# EAGLE design RQ2_supply_v0.1 (EAGLE 7.6.0)
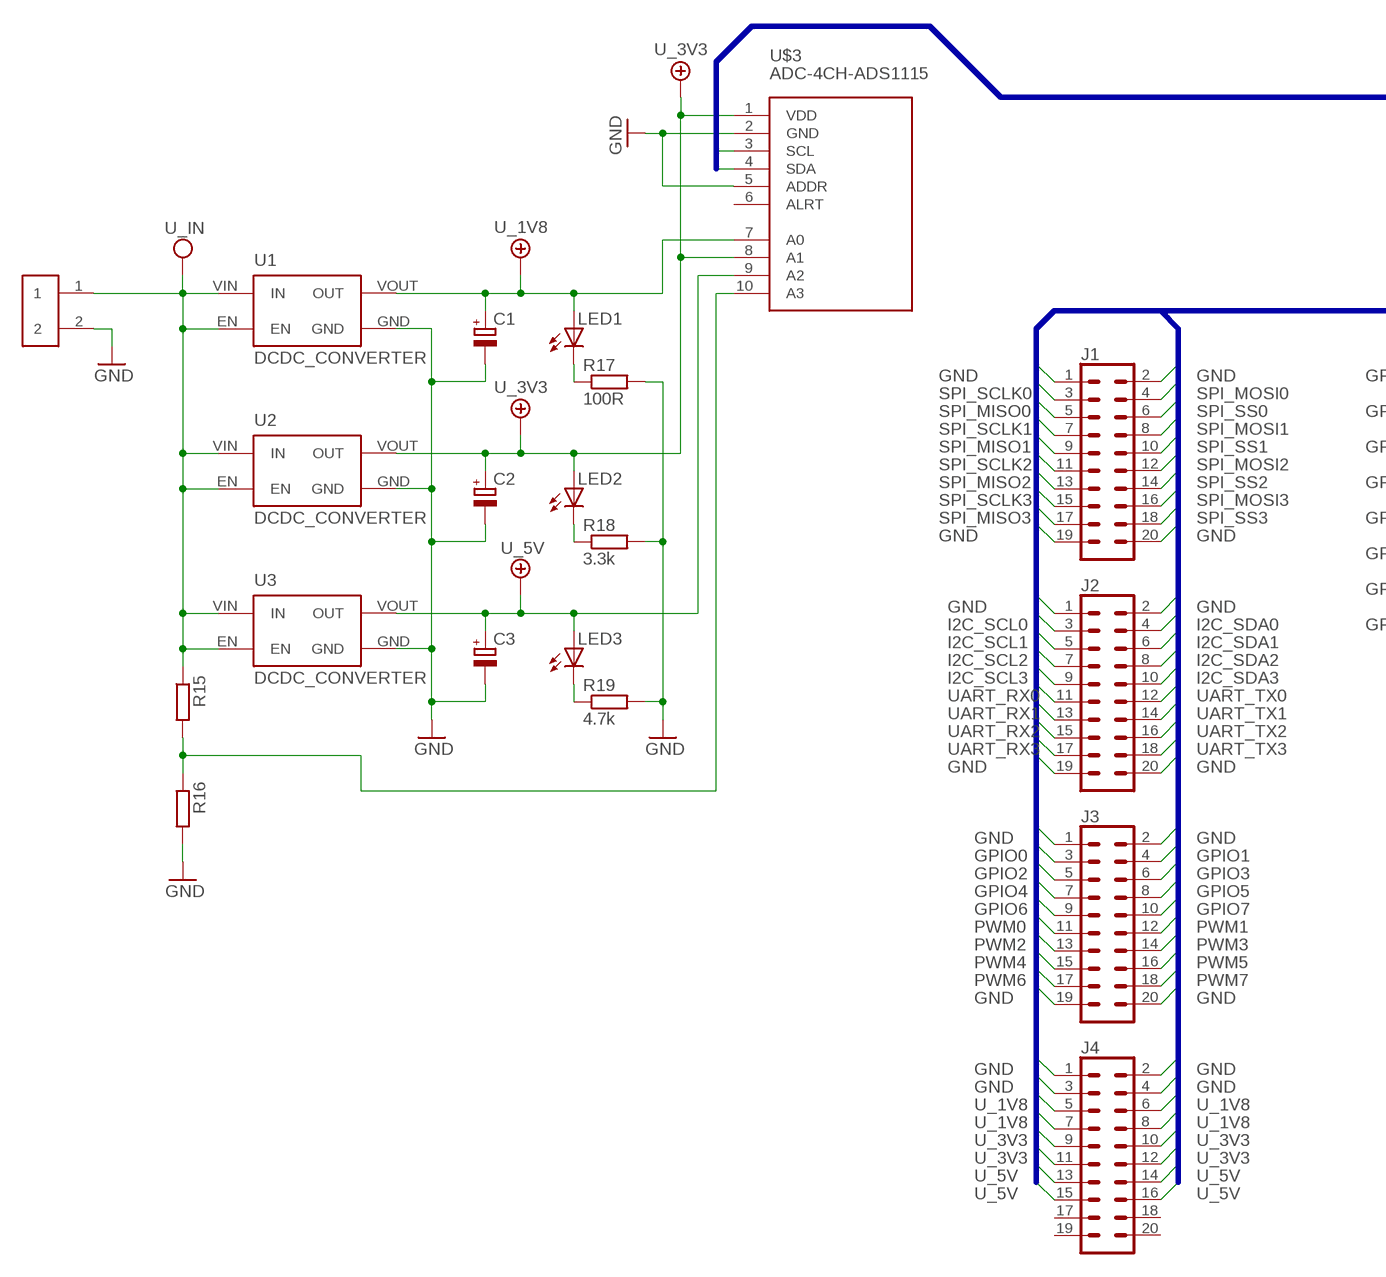
[diagram p0: schematic, sheet 1, part 1 of 2]
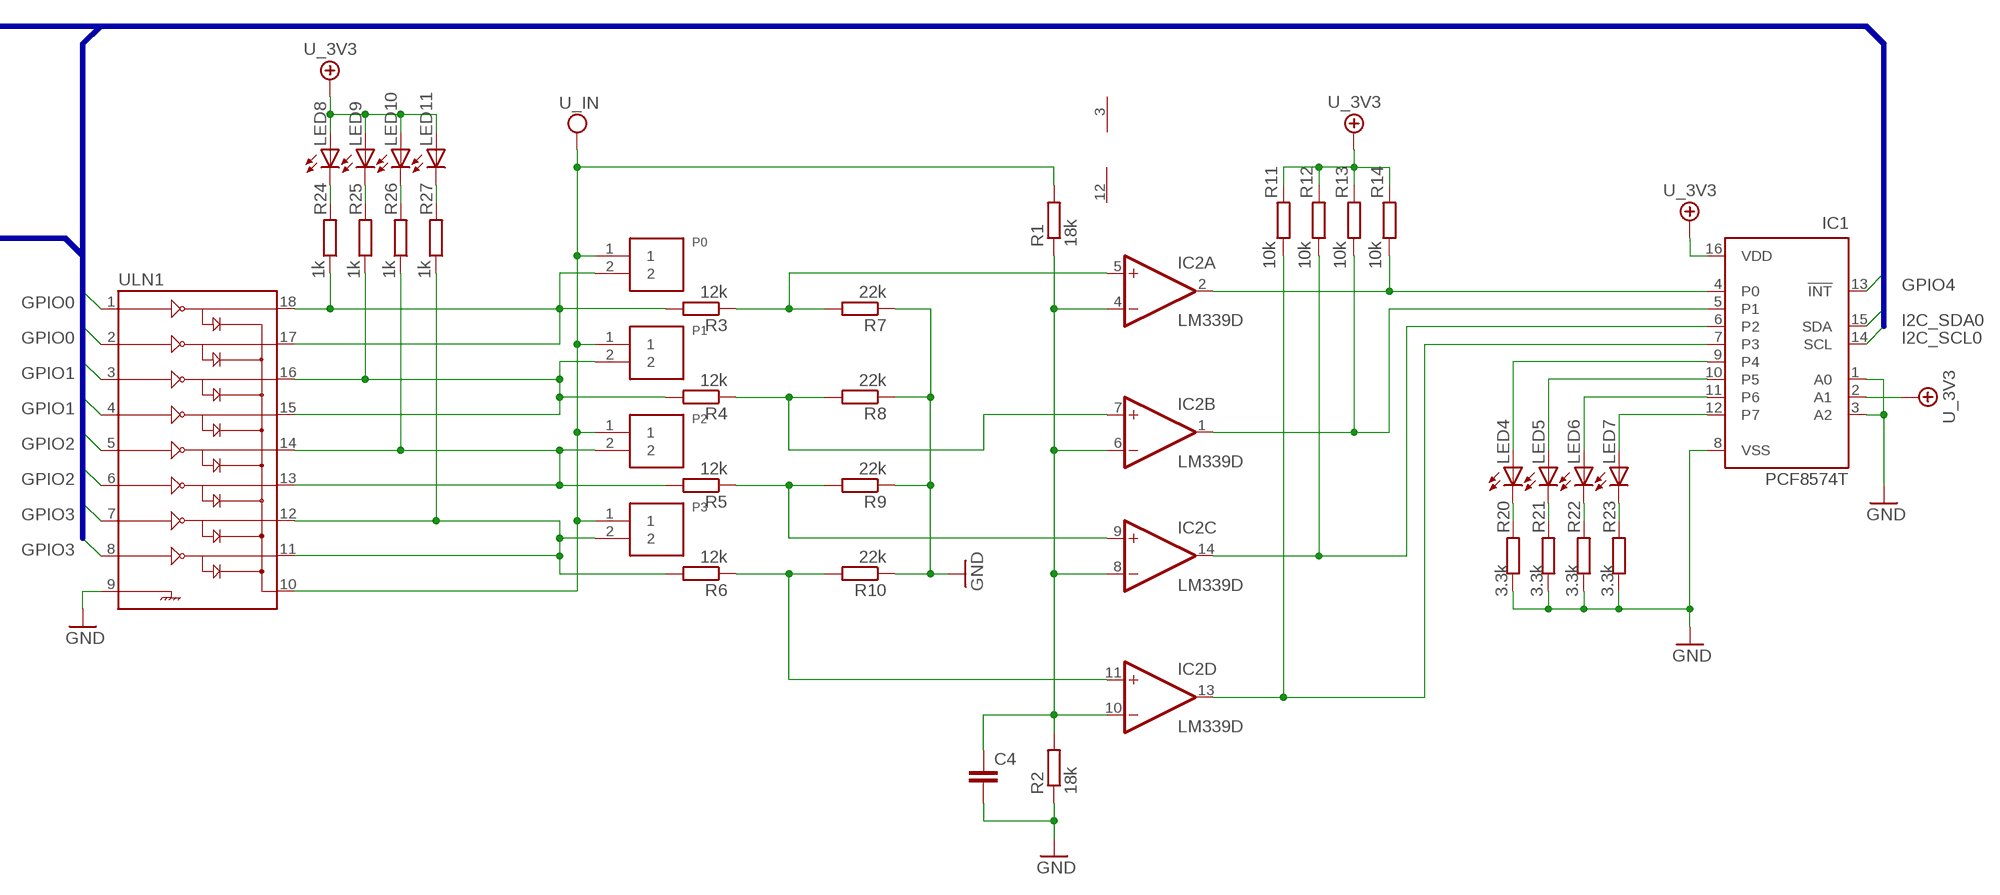
[diagram p1: schematic, sheet 1, part 2 of 2]

## Parts
C1  CPOL-EUSANYO_E9  [SANYO-OSCON_E9]
C2  CPOL-EUSANYO_E9  [SANYO-OSCON_E9]
C3  CPOL-EUSANYO_E9  [SANYO-OSCON_E9]
C4  C-EUC0805  [C0805]
IC1  PCF8574T  [SO16W]
IC2  LM339D  [SO14]
J1  CONN_10X2  [2X10]
J2  CONN_10X2  [2X10]
J3  CONN_10X2  [2X10]
J4  CONN_10X2  [2X10]
LED1  LEDSML0805  [SML0805]
LED2  LEDSML0805  [SML0805]
LED3  LEDSML0805  [SML0805]
LED4  LEDSML0805  [SML0805]
LED5  LEDSML0805  [SML0805]
LED6  LEDSML0805  [SML0805]
LED7  LEDSML0805  [SML0805]
LED8  LEDSML0805  [SML0805]
LED9  LEDSML0805  [SML0805]
LED10  LEDSML0805  [SML0805]
LED11  LEDSML0805  [SML0805]
P0  2PIN  [B2B-PH-K-S]
P1  2PIN  [B2B-PH-K-S]
P2  2PIN  [B2B-PH-K-S]
P3  2PIN  [B2B-PH-K-S]
R1  18k  R-EU_R0805  [R0805]
R2  18k  R-EU_R0805  [R0805]
R3  12k  R-EU_R0805  [R0805]
R4  12k  R-EU_R0805  [R0805]
R5  12k  R-EU_R0805  [R0805]
R6  12k  R-EU_R0805  [R0805]
R7  22k  R-EU_R0805  [R0805]
R8  22k  R-EU_R0805  [R0805]
R9  22k  R-EU_R0805  [R0805]
R10  22k  R-EU_R0805  [R0805]
R11  10k  R-EU_R0805  [R0805]
R12  10k  R-EU_R0805  [R0805]
R13  10k  R-EU_R0805  [R0805]
R14  10k  R-EU_R0805  [R0805]
R15  R-EU_R0805  [R0805]
R16  R-EU_R0805  [R0805]
R17  100R  R-EU_R0805  [R0805]
R18  3.3k  R-EU_R0805  [R0805]
R19  4.7k  R-EU_R0805  [R0805]
R20  3.3k  R-EU_R0805  [R0805]
R21  3.3k  R-EU_R0805  [R0805]
R22  3.3k  R-EU_R0805  [R0805]
R23  3.3k  R-EU_R0805  [R0805]
R24  1k  R-EU_R0805  [R0805]
R25  1k  R-EU_R0805  [R0805]
R26  1k  R-EU_R0805  [R0805]
R27  1k  R-EU_R0805  [R0805]
U1  DCDC_CONVERTER  [DCDC_CONVERTER]
U2  DCDC_CONVERTER  [DCDC_CONVERTER]
U3  DCDC_CONVERTER  [DCDC_CONVERTER]
U$1  XT_CONN  [XT30_PCB]
U$3  ADC-4CH-ADS1115  [ADC-4CH-ADS1115]
ULN1  ULN2803SOICW  [SO18L]

## Nets
COMPARE: C4.1 IC2.4(A:-IN) IC2.6(B:-IN) IC2.8(C:-IN) IC2.10(D:-IN) R1.1 R2.2
GND: C1.- C2.- C3.- C4.2 IC1.1(A0) IC1.3(A2) IC1.8(VSS) J1.1 J1.2 J1.19 J1.20 J2.1 J2.2 J2.19 J2.20 J3.1 J3.2 J3.19 J3.20 J4.1 J4.2 J4.3 J4.4 R2.1 R7.1 R8.1 R9.1 R10.1 R16.2 R17.2 R18.2 R19.2 R20.1 R21.1 R22.1 R23.1 U1.GND U2.GND U3.GND U$1.2 U$3.2(GND) U$3.5(ADDR) ULN1.9
GPIO0: J3.3 ULN1.1 ULN1.2
GPIO1: J3.4 ULN1.3 ULN1.4
GPIO2: J3.5 ULN1.5 ULN1.6
GPIO3: J3.6 ULN1.7 ULN1.8
GPIO4: IC1.13(!INT) J3.7
GPIO5: J3.8
GPIO6: J3.9
GPIO7: J3.10
I2C_SCL0: IC1.14(SCL) J2.3 U$3.3(SCL)
I2C_SCL1: J2.5
I2C_SCL2: J2.7
I2C_SCL3: J2.9
I2C_SDA0: IC1.15(SDA) J2.4 U$3.4(SDA)
I2C_SDA1: J2.6
I2C_SDA2: J2.8
I2C_SDA3: J2.10
LED4: LED4.C R20.2
LED5: LED5.C R21.2
LED6: LED6.C R22.2
LED7: LED7.C R23.2
N$1: R15.2 R16.1 U$3.10(A3)
N$2: LED1.C R17.1
N$3: LED2.C R18.1
N$4: LED3.C R19.1
N$5: LED8.C R24.2
N$6: LED9.C R25.2
N$7: LED10.C R26.2
N$8: LED11.C R27.2
NOT_BLOWN0: IC1.4(P0) IC2.2(A:OUT) R14.1
NOT_BLOWN1: IC1.5(P1) IC2.1(B:OUT) R13.1
NOT_BLOWN2: IC1.6(P2) IC2.14(C:OUT) R12.1
NOT_BLOWN3: IC1.7(P3) IC2.13(D:OUT) R11.1
P4: IC1.9(P4) LED4.A
P5: IC1.10(P5) LED5.A
P6: IC1.11(P6) LED6.A
P7: IC1.12(P7) LED7.A
PWM0: J3.11
PWM1: J3.12
PWM2: J3.13
PWM3: J3.14
PWM4: J3.15
PWM5: J3.16
PWM6: J3.17
PWM7: J3.18
PYRO0: P0.2 R3.2 R24.1 ULN1.17 ULN1.18
PYRO1: P1.2 R4.2 R25.1 ULN1.15 ULN1.16
PYRO2: P2.2 R5.2 R26.1 ULN1.13 ULN1.14
PYRO3: P3.2 R6.2 R27.1 ULN1.11 ULN1.12
PYRO_PROBE0: IC2.5(A:+IN) R3.1 R7.2
PYRO_PROBE1: IC2.7(B:+IN) R4.1 R8.2
PYRO_PROBE2: IC2.9(C:+IN) R5.1 R9.2
PYRO_PROBE3: IC2.11(D:+IN) R6.1 R10.2
SPI_MISO0: J1.5
SPI_MISO1: J1.9
SPI_MISO2: J1.13
SPI_MISO3: J1.17
SPI_MOSI0: J1.4
SPI_MOSI1: J1.8
SPI_MOSI2: J1.12
SPI_MOSI3: J1.16
SPI_SCLK0: J1.3
SPI_SCLK1: J1.7
SPI_SCLK2: J1.11
SPI_SCLK3: J1.15
SPI_SS0: J1.6
SPI_SS1: J1.10
SPI_SS2: J1.14
SPI_SS3: J1.18
U_1V8: C1.+ J4.5 J4.6 J4.7 J4.8 LED1.A U1.VOUT(OUT) U$3.7(A0)
U_3V3: C2.+ IC1.2(A1) IC1.16(VDD) J4.9 J4.10 J4.11 J4.12 LED2.A LED8.A LED9.A LED10.A LED11.A R11.2 R12.2 R13.2 R14.2 U2.VOUT(OUT) U$3.1(VDD) U$3.8(A1)
U_5V: C3.+ J4.13 J4.14 J4.15 J4.16 LED3.A U3.VOUT(OUT) U$3.9(A2)
U_IN: P0.1 P1.1 P2.1 P3.1 R1.2 R15.1 U1.EN U1.VIN(IN) U2.EN U2.VIN(IN) U3.EN U3.VIN(IN) U$1.1 ULN1.10
UART_RX0: J2.11
UART_RX1: J2.13
UART_RX2: J2.15
UART_RX3: J2.17
UART_TX0: J2.12
UART_TX1: J2.14
UART_TX2: J2.16
UART_TX3: J2.18
Unconnected: J4.17 J4.18 J4.19 J4.20 U$3.6(ALRT)

## Buses
SPI_SCLK[0..3],SPI_MOSI[0..3],SPI_MISO[0..3],SPI_SS[0..3],I2C_SCL[0..3],I2C_SDA[0..3],SD0_CLK,SD0_CMD,SD0_DAT[0..3],SD1_CLK,SD1_CMD,SD1_DAT[0..3],GPIO[0..7],ADC[0..7],PWM[0..7],UART_RX[0..3],UART_TX[0..3],RESET_N,XIN,XOUT,U_1V8,U_3V3,U_5V,U_IN,GND

## Power pins joined to a net without a drawn wire
GND: IC2.12(P:GND)
V+: IC2.3(P:V+)

## Library data of the parts
C1-C3 = rcl:CPOL-EU: POLARIZED CAPACITOR, European symbol
C4 = rcl:C-EU: CAPACITOR, European symbol
IC1 = micro-philips:PCF8574: I2C-Bus Remote 8-bit I/O expander http://www.semiconductors.philips.com/acrobat_download/datasheets/PCF8574_4.pdf; MPN: PCF8574T/3,512; OC_FARNELL: 1201255; OC_NEWARK: 70R6870
IC2 = linear:LM339: Low Power Low Offset Voltage Quad Comparators with open collector; LM139/LM239/LM339/LM2901/LM3302
J1-J4 = SparkFun-Connectors:CONN_10X2: Multi connection point. Often used as Generic Header-pin footprint for 0.1 inch spaced/style header connections On any of the 0.1 inch spaced packages, you can populate with these: Break Away Headers - Straight <https://www.sparkfun.com/products/116> (PRT-00116) Break Away Male Headers - Right Angle <https://www.sparkfun.com/products/553> (PRT-00553) Female Headers <https://www.sparkfun.com/products/115> (PRT-00115) Break Away Headers - Machine Pin <https://www.sparkfun.com/products/117> (PRT-00117) Break Away Female Headers - Swiss Machine Pin <https://www.sparkfun.com/products/743> (PRT-00743) Special note about the "SPECIAL" package: This was SPECIALLY designed to be used with our Graphic LCD Backpack. Be sure you want to use this! It is not only staggered on each line of header holes, but IT IS ALSO offset of the center point of the top and bottom lines by 5 mil. This causes the headers to lock into place on the "standard" footprint on the LCD screen. The extra squares on the tdocu layer are there simply to reference other pins (if you were to actually populate a longer header than ten long - this is what we do with the backpacks).
LED1-LED11 = led:LED: LED OSRAM: - CHIPLED LG R971, LG N971, LY N971, LG Q971, LY Q971, LO R971, LY R971 LH N974, LH R974 LS Q976, LO Q976, LY Q976 LO Q996 - Hyper CHIPLED LW Q18S LB Q993, LB Q99A, LB R99A - SideLED LS A670, LO A670, LY A670, LG A670, LP A670 LB A673, LV A673, LT A673, LW A673 LH A674 LY A675 LS A676, LA A676, LO A676, LY A676, LW A676 LS A679, LY A679, LG A679 - Hyper Micro SIDELED® LS Y876, LA Y876, LO Y876, LY Y876 LT Y87S - SmartLED LW L88C, LW L88S LB L89C, LB L89S, LG L890 LS L89K, LO L89K, LY L89K LS L896, LA L896, LO L896, LY L896 - TOPLED LS T670, LO T670, LY T670, LG T670, LP T670 LSG T670, LSP T670, LSY T670, LOP T670, LYG T670 LG T671, LOG T671, LSG T671 LB T673, LV T673, LT T673, LW T673 LH T674 LS T676, LA T676, LO T676, LY T676, LB T676, LH T676, LSB T676, LW T676 LB T67C, LV T67C, LT T67C, LS T67K, LO T67K, LY T67K, LW E67C LS E67B, LA E67B, LO E67B, LY E67B, LB E67C, LV E67C, LT E67C LW T67C LS T679, LY T679, LG T679 LS T770, LO T770, LY T770, LG T770, LP T770 LB T773, LV T773, LT T773, LW T773 LH T774 LS E675, LA E675, LY E675, LS T675 LS T776, LA T776, LO T776, LY T776, LB T776 LHGB T686 LT T68C, LB T68C - Hyper Mini TOPLED® LB M676 - Mini TOPLED Santana® LG M470 LS M47K, LO M47K, LY M47K Source: http://www.osram.convergy.de LUXEON: - LUMILED® LXK2-PW12-R00, LXK2-PW12-S00, LXK2-PW14-U00, LXK2-PW14-V00 LXK2-PM12-R00, LXK2-PM12-S00, LXK2-PM14-U00 LXK2-PE12-Q00, LXK2-PE12-R00, LXK2-PE12-S00, LXK2-PE14-T00, LXK2-PE14-U00 LXK2-PB12-K00, LXK2-PB12-L00, LXK2-PB12-M00, LXK2-PB14-N00, LXK2-PB14-P00, LXK2-PB14-Q00 LXK2-PR12-L00, LXK2-PR12-M00, LXK2-PR14-Q00, LXK2-PR14-R00 LXK2-PD12-Q00, LXK2-PD12-R00, LXK2-PD12-S00 LXK2-PH12-R00, LXK2-PH12-S00 LXK2-PL12-P00, LXK2-PL12-Q00, LXK2-PL12-R00 Source: www.luxeon.com KINGBRIGHT: KA-3528ASYC Source: www.kingbright.com
P0 P1-P3 = jst_eph:2PIN
R1-R27 = rcl:R-EU_: RESISTOR, European symbol
U1-U3 = arduino_modules:DCDC_CONVERTER
U$1 = SparkFun-Connectors:XT_CONN
U$3 = diy-modules:ADC-4CH-ADS1115: 4 Channel 16-Bit Analog-to-Digital Converter based on ADS1115 chip Arduino ADS1115 Getting Started Tutorial is available here: http://henrysbench.capnfatz.com/henrys-bench/arduino-voltage-measurements/arduino-ads1115-module-getting-started-tutorial/ ADS1115 datasheet is available here: http://www.ti.com/lit/ds/symlink/ads1115.pdf Click here to find device on ebay.com <http://www.ebay.com/sch/ads1115+module>
ULN1 = SparkFun-IC-Special-Function:ULN2803: Darlington Driver(IC-07959, low stock) ULN2803 Darlington array. 500mA max per channel, 8-channel package. Spark Fun Electronics SKU : COM-00312

## Board
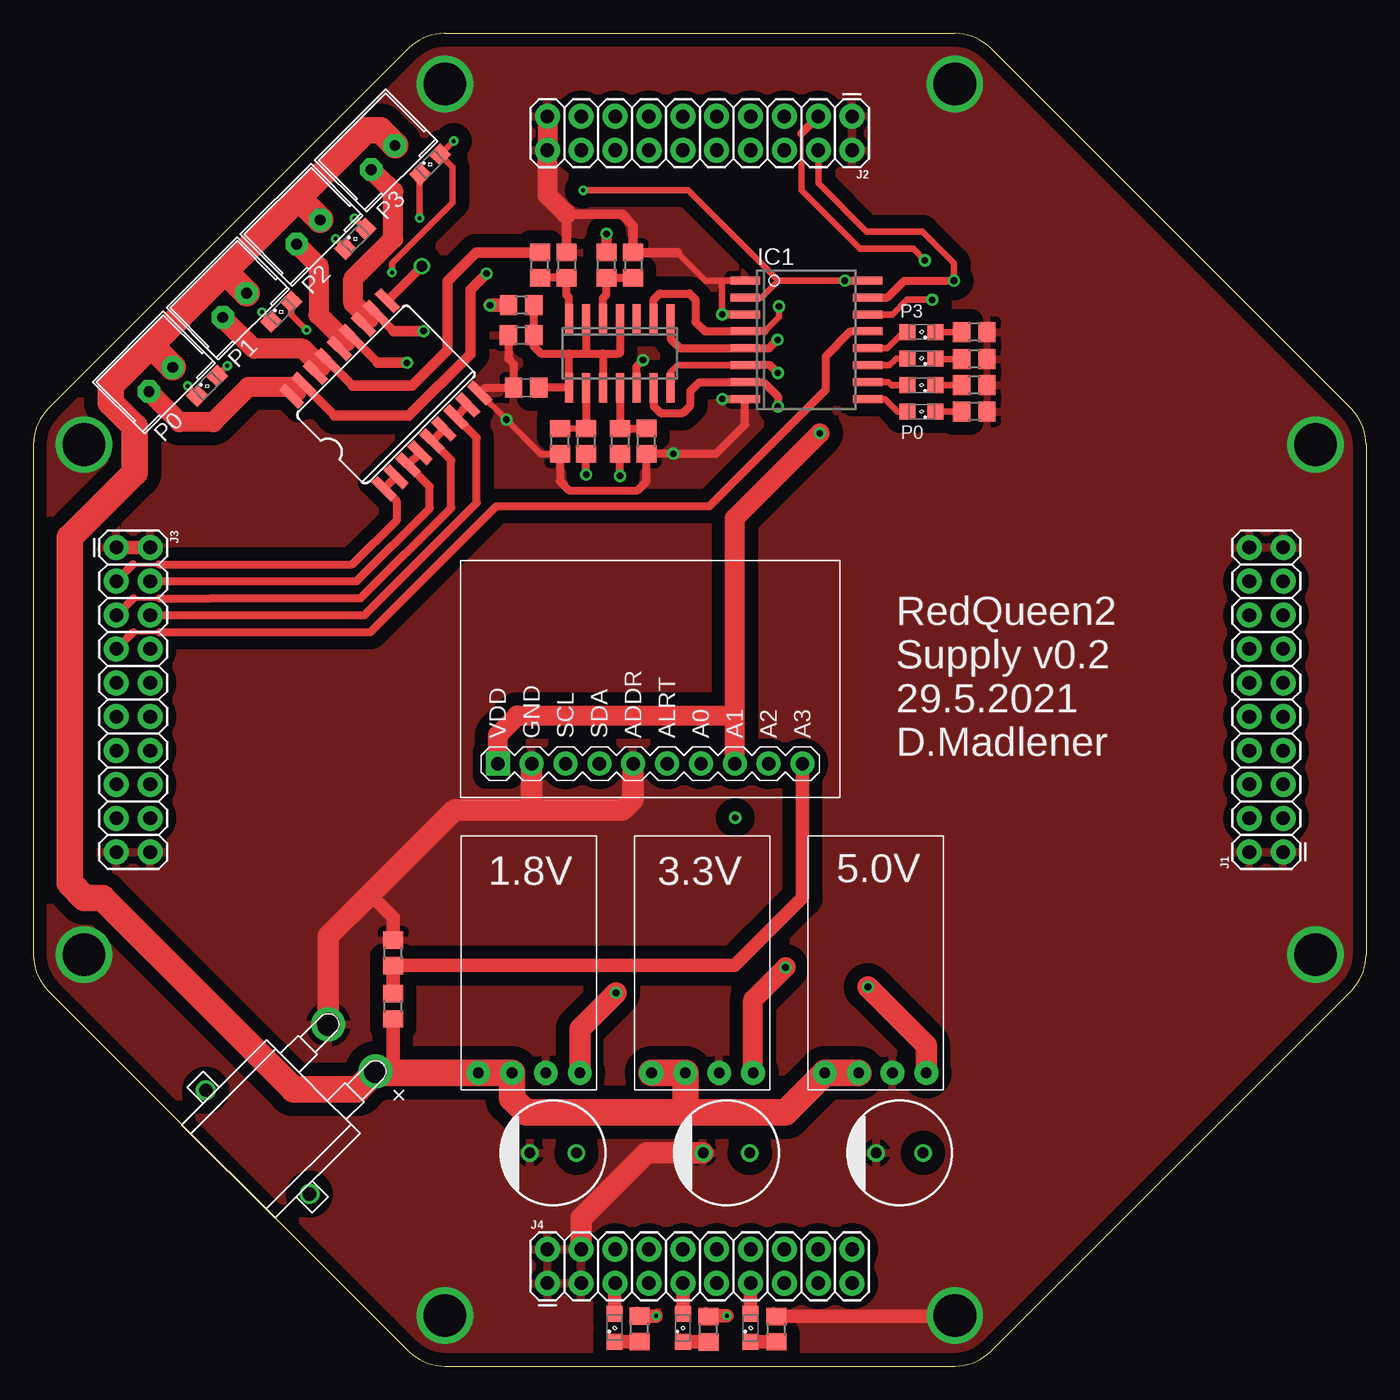
[diagram p2: board, top side]
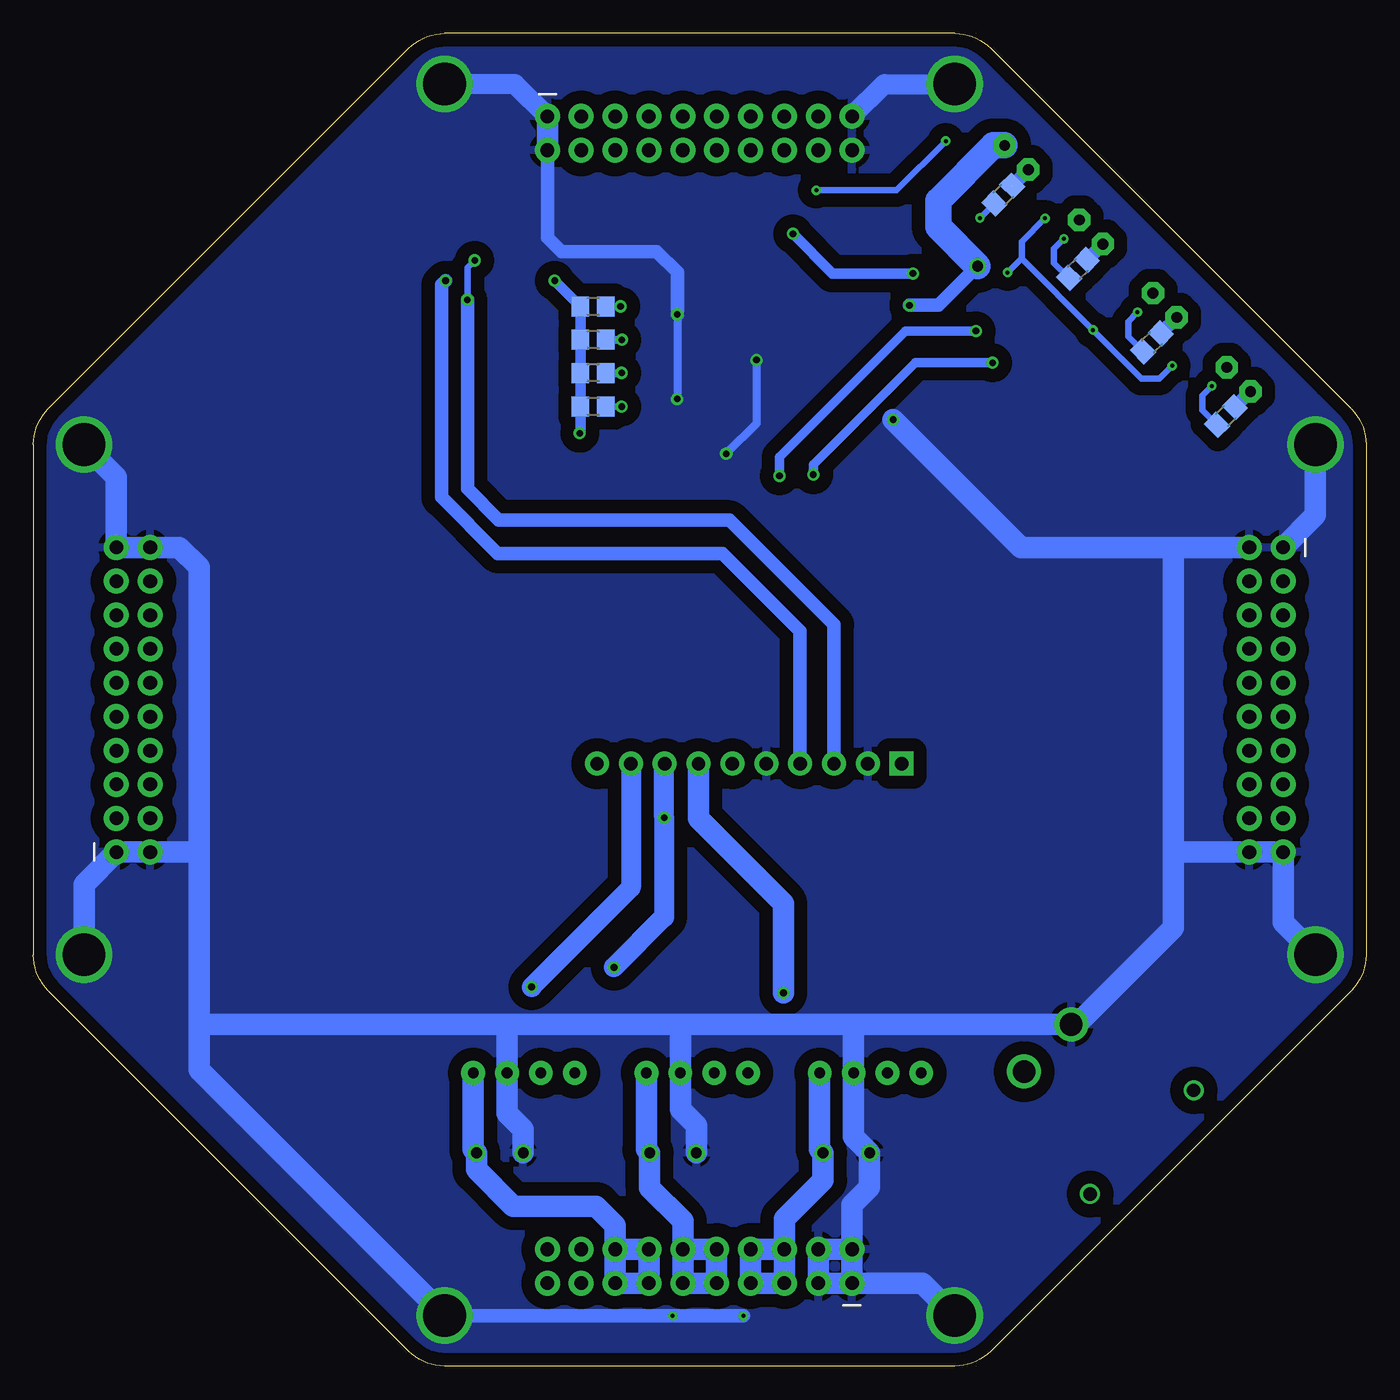
[diagram p3: board, bottom side, seen from below]

Size 100 x 100 mm. Coordinates in mm from the lower left corner, seen from the top.
Outline: 100,70.71 100,70.71
Outline: 100,29.29 100,29.29
Outline: 29.29,100 29.29,100
Outline: 70.71,100 70.71,100
Outline: 100,29.29 100,29.29
Outline: 70.71,0 70.71,0
Outline: 70.71,100 70.71,100
Outline: 100,70.71 100,70.71
Outline: 0,70.71 0,70.71
Outline: 26.36,97.07 26.36,97.07
Outline: 2.93,73.64 2.93,73.64
Outline: 29.29,100 29.29,100
Outline: 29.29,0 29.29,0
Outline: 2.93,26.36 2.93,26.36
Outline: 0,29.29 0,29.29
Outline: 0,70.71 0,70.71
Outline: 26.36,2.93 26.36,2.93
Outline: 0,29.29 0,29.29
Outline: 70.71,0 70.71,0
Outline: 29.29,0 29.29,0
Outline: 1.12,71.83 arc45 0,69.14 0,30.87 arc45 1.12,28.17 28.18,1.12 arc45 30.87,0 69.14,0 arc45 71.83,1.12 98.89,28.17 arc45 100,30.87 100,69.13 arc45 98.89,71.83 71.83,98.89 arc45 69.13,100 30.87,100 arc45 28.18,98.89 1.12,71.83
Copper layers (1*16): Top 0.035mm / dielectric 1.5mm / Bottom 0.035mm
Design rules "default *": minimum track width 10mil, minimum drill 0.3mm, track to track 6mil, track to pad 6mil, pad to pad 6mil, via to via 6mil, smd to smd 6mil, copper to edge 20mil, drill to drill 8mil, minimum pad ring 10mil, minimum via ring 8mil, stop-mask expansion 4mil, vias tented up to drill 0mil, thermal gap 16mil

### Footprints (pad centres in the part's own frame; a part is rotated, then mirrored left to right if it is on the bottom)
SANYO-OSCON_E9 = drill 0.8 pad 1.27: + 1.75,0; - -1.75,0
C0805 = smd 1.3 x 1.5: 1 -0.95,0; 2 0.95,0
SO16W = smd 0.6 x 2.2: 1 -4.445,-4.6; 2 -3.175,-4.6; 3 -1.905,-4.6; 4 -0.635,-4.6; 5 0.635,-4.6; 6 1.905,-4.6; 7 3.175,-4.6; 8 4.445,-4.6; 9 4.445,4.6; 10 3.175,4.6; 11 1.905,4.6; 12 0.635,4.6; 13 -0.635,4.6; 14 -1.905,4.6; 15 -3.175,4.6; 16 -4.445,4.6
SO14 = smd 0.6 x 2.2: 1 -3.81,-2.6; 2 -2.54,-2.6; 3 -1.27,-2.6; 4 0,-2.6; 5 1.27,-2.6; 6 2.54,-2.6; 7 3.81,-2.6; 8 3.81,2.6; 9 2.54,2.6; 10 1.27,2.6; 11 0,2.6; 12 -1.27,2.6; 13 -2.54,2.6; 14 -3.81,2.6
2X10 = drill 1.016 pad 1.88: 1 0,0; 2 0,2.54; 3 2.54,0; 4 2.54,2.54; 5 5.08,0; 6 5.08,2.54; 7 7.62,0; 8 7.62,2.54; 9 10.16,0; 10 10.16,2.54; 11 12.7,0; 12 12.7,2.54; 13 15.24,0; 14 15.24,2.54; 15 17.78,0; 16 17.78,2.54; 17 20.32,0; 18 20.32,2.54; 19 22.86,0; 20 22.86,2.54
SML0805 = smd 1.2 x 1.2: A 1.05,0; C -1.05,0
B2B-PH-K-S = drill 0.813 pad 1.676 octagon: 1 1.27,0.025; 2 -1.27,0
R0805 = smd 1.3 x 1.5: 1 -0.95,0; 2 0.95,0
DCDC_CONVERTER = drill 0.8 pad 1.778: EN 0,-7.62; GND 0,-2.54; VIN 0,-5.08; VOUT 0,0
XT30_PCB = drill 1.7: 1 -2.5,0; 2 2.5,0 | drill 1: AUX1 -5.5,10; AUX2 5.5,10
ADC-4CH-ADS1115 = drill 1 pad 1.8 square: 1 -6.35,11.43 | drill 1 pad 1.8: 2 -6.35,8.89; 3 -6.35,6.35; 4 -6.35,3.81; 5 -6.35,1.27; 6 -6.35,-1.27; 7 -6.35,-3.81; 8 -6.35,-6.35; 9 -6.35,-8.89; 10 -6.35,-11.43
SO18L = smd 0.66 x 2.032: 1 -0.635,-4.902; 2 0.635,-4.902; 3 1.905,-4.902; 4 3.175,-4.902; 5 4.445,-4.902; 6 5.715,-4.902; 7 6.985,-4.902; 8 8.255,-4.902; 9 9.525,-4.902; 10 9.525,4.902; 11 8.255,4.902; 12 6.985,4.902; 13 5.715,4.902; 14 4.445,4.902; 15 3.175,4.902; 16 1.905,4.902; 17 0.635,4.902; 18 -0.635,4.902

### Placement (x,y rotation side)
C1  39,16 0 top
C2  52,16 0 top
C3  65,16 0 top
C4  36.99,73.42 180 top
IC1  58,77.01 270 top
IC2  44,76 180 top
J1  93.77,38.57 90 top
J2  61.43,93.77 180 top
J3  6.23,61.43 270 top
J4  38.57,6.23 0 top
LED1  43.6,2.88 90 top
LED2  48.73,2.87 90 top
LED3  53.8,2.87 90 top
LED4  66.65,71.61 180 top
LED5  66.65,73.6 180 top
LED6  66.64,75.59 180 top
LED7  66.64,77.6 180 top
LED8  13.04,73.55 45 top
LED9  18.6,79.12 45 top
LED10  24.16,84.59 45 top
LED11  29.77,90.17 45 top
P0  9.58,74.03 45 top
P1  15.12,79.59 45 top
P2  20.65,85.09 45 top
P3  26.25,90.68 45 top
R1  36.6,79.6 180 top
R2  36.6,77.34 0 top
R3  43,82.61 90 top
R4  38,82.61 90 top
R5  41.47,69.4 270 top
R6  44.01,69.4 270 top
R7  45.01,82.61 270 top
R8  40,82.61 270 top
R9  39.51,69.4 90 top
R10  46.01,69.41 90 top
R11  58,72 180 bottom
R12  58,74.53 180 bottom
R13  58,77.01 180 bottom
R14  58,79.51 180 bottom
R15  27,27 90 top
R16  27,31 90 top
R17  45.49,2.81 90 top
R18  50.65,2.77 90 top
R19  55.75,2.78 90 top
R20  70.59,71.63 180 top
R21  70.59,73.6 180 top
R22  70.59,75.57 180 top
R23  70.59,77.59 180 top
R24  10.53,71.29 225 bottom
R25  16.08,76.82 225 bottom
R26  21.63,82.33 225 bottom
R27  27.23,87.9 225 bottom
U1  41,22.01 270 top
U2  54,22.01 270 top
U3  67,22 270 top
U$1  23.9,23.88 135 top
U$3  46.28,51.55 90 top
ULN1  23.3,69.75 45 top

### Tracks (layer width: path | path; a pad name or v marks a point on that pad's centre or on a via)
COMPARE
  Top 0.4: R1.1
  Top 0.5: 43.9,75.99 43.99,75.99 44,75.99
  Top 0.6: 42.73,75.99 IC2.10 | R1.1 R2.2 37.55,76.53 38.09,75.99 40.19,75.99 | C4.1 40.18,73.42 IC2.8 40.19,75.99 | 40.19,75.99 41.46,75.99 | 41.46,75.99 42.73,75.99 | 42.73,75.99 43.9,75.99 | IC2.6 41.46,75.99 | IC2.4 44,75.99
GND  (via drill 0.3, 0.5, 3.2)
  Top 0.5: ULN1.9 v35.49,71.02 38.06,68.45 R9.1 | IC1.8 | IC1.1 51.69,81.45 | 48.32,83.56 50.43,81.45 51.69,81.45 | 51.69,81.45 v51.69,78.91
  Top 0.6: R9.1 39.51,66.39 40.2,65.71 45.33,65.71 46.01,66.39 R10.1 v48.02,68.46 51.21,68.46 53.4,70.66 IC1.8 | IC2.12 45.27,75.02 v45.74,75.49 | IC1.3 v51.69,78.91 | v51.7,72.57 IC1.8 | ULN1.9 33.9,73.42 C4.2 36.04,75.19 35.65,75.58 R2.1
  Top 0.7: 48.32,83.56 R7.1 45.01,85.58 44.16,86.44 40,86.44 R8.1
  Top 1: J3.1 J3.2 | R16.2 27,33.66 25.26,35.41 | R19.2 69.14,3.73 v69.14,3.8 | R17.2 v46.73,3.76 v46.73,3.77 | v52.03,3.78 50.65,3.78 R18.2
  Top 1.5: J2.19 J2.20 38.57,87.87 40,86.44
  Top 1.6: J4.4 41.11,11.1 46.01,16 C2.- | U$3.5 45.01,42.54 44.22,41.74 37.39,41.74 | U$1.2 22.13,32.28 25.26,35.41 31.59,41.74 37.39,41.74 | U$3.2 37.39,41.74
  Bottom 0.5: 11.15,61.43 J3.2 | 11.97,61.37 11.91,61.43 | 51.69,72.58 v51.7,72.57
  Bottom 0.6: v45.74,75.49 45.74,70.74 v48.02,68.46 | v51.69,78.91 51.69,72.58
  Bottom 0.8: J4.3
  Bottom 1: J2.2 61.43,84.69 60.37,83.62 53.24,83.62 51.69,82.07 v51.69,78.91 | v46.73,3.77 46.97,3.77 46.97,3.78 v52.03,3.78 69.14,3.78 v69.14,3.8
  Bottom 1.5: J2.1 63.86,96.2 v69.14,96.2 | J2.19 36.14,96.2 v30.88,96.2
  Bottom 1.6: J4.2 J4.1 33.31,6.23 v30.88,3.8 | J4.2 J4.4 J4.3 J4.1 | 38.46,25.65 U$1.2 21.69,25.65 14.47,32.87 14.47,38.57 | 38.46,25.65 U1.GND 38.46,17.21 C1.- 37.25,13.43 38.57,12.11 J4.2 | 38.46,25.65 51.46,25.65 | U2.GND 51.46,25.65 | C2.- 50.25,18.07 51.46,19.28 U2.GND | J2.1 J2.2 | J3.2 11.91,61.43 14.47,61.43 | 14.47,61.43 25.91,61.43 v35.49,71.02 | v96.2,30.88 96.2,36.14 J1.1 J1.2 87.57,38.57 | v96.2,69.14 93.77,66.71 J1.19 J1.20 89.04,61.43 87.57,59.96 87.57,38.57 | v3.8,69.14 3.8,63.86 J3.1 | v69.14,3.8 87.57,22.23 87.57,25.65 | 87.57,25.65 87.57,38.57 | 51.46,25.65 64.46,25.65 | 64.46,25.65 87.57,25.65 | 64.46,25.65 U3.GND 64.46,18.97 63.25,17.76 C3.- | v3.8,30.88 6.23,33.31 J3.19 J3.20 14.47,38.57 | 14.47,38.57 14.47,61.43
  pour Top (isolate 1): 70.7,100.01 100,70.71 100,29.29 70.72,0 29.3,0 0,29.29 0,70.71 29.29,100
  pour Bottom (isolate 1): 70.7,100.01 100,70.71 100,29.29 70.72,0 29.3,0 0,29.29 0,70.71 29.29,100
GPIO0
  Top 0.3: 7.47,60.15 9.44,60.15
  Top 0.406: J3.3 6.22,58.89
  Top 0.6: 6.22,58.89 7.47,60.15 | 9.44,60.15 23.93,60.15 27.28,63.5 27.28,64.86 ULN1.1 ULN1.2
GPIO1
  Top 0.6: J3.4 24.27,58.89 29.74,64.36 29.74,66 ULN1.3 ULN1.4
GPIO2
  Top 0.3: 7.5,57.61 9.46,57.61
  Top 0.406: J3.5 | 13.32,57.61 13.33,57.62 | ULN1.5
  Top 0.6: ULN1.6 ULN1.5 31.35,67.98 31.35,64.4 24.56,57.62 13.33,57.62 | J3.5 7.5,57.61 | 9.46,57.61 13.32,57.61
GPIO3
  Top 0.406: ULN1.7
  Top 0.6: J3.6 24.84,56.35 33.27,64.78 33.27,69.65 ULN1.7 ULN1.8
GPIO4
  Top 0.3: 7.5,55.08 9.45,55.08
  Top 0.6: J3.7 7.5,55.08 | 9.45,55.08 25.3,55.08 34.75,64.53 50.72,64.53 59.45,73.27 59.45,75.78 61.31,77.64 IC1.13
I2C_SCL0  (via drill 0.5)
  Top 0.3: 57.62,92.49 57.62,90.12
  Top 0.5: 57.62,92.49 57.62,92.5 | 57.62,90.12 57.62,88.22 62.01,83.83 66.02,83.83 v66.89,82.96 | IC1.14 64.46,78.91 65.56,80.01 v67.44,80.01
  Top 0.6: 57.62,92.5 J2.3
  Bottom 0.5: v67.44,80.01 67.44,82.41 v66.89,82.96
  Bottom 1: U$3.3 39.93,55.64 47.77,63.48 65.08,63.48 67.44,65.83 v67.44,80.01
I2C_SDA0  (via drill 0.5)
  Top 0.5: J2.4 58.89,88.77 62.52,85.14 66.7,85.14 69.07,82.76 v69.07,81.44
  Top 0.6: IC1.15 64.08,80.18 65.34,81.44 v69.07,81.44
  Bottom 1: U$3.4 42.47,55.15 48.3,60.98 65.16,60.98 69.38,65.21 69.38,81.13 v69.07,81.44
LED4
  Top 0.5: LED4.C 67.72,71.63 R20.2
LED5
  Top 0.5: LED5.C R21.2
LED6
  Top 0.5: LED6.C 67.71,75.57 R22.2
LED7
  Top 0.5: LED7.C R23.2
N$1
  Top 1: R15.2 R16.1 52.61,30.05 57.71,35.15 U$3.10
N$2
  Top 1: LED1.C 45.49,1.83 R17.1
N$3
  Top 1: LED2.C R18.1
N$4
  Top 1: LED3.C R19.1
N$5  (via drill 0.3)
  Top 0.5: LED8.C 12.3,72.82 v11.58,73.54
  Bottom 0.5: R24.2 12.3,71.71 LED8.C 11.58,73.52 v11.58,73.54
N$6  (via drill 0.3)
  Top 0.5: v17.16,79.08 LED9.C
  Bottom 0.5: R25.2 17.86,77.25 LED9.C v17.16,79.08
N$7  (via drill 0.3)
  Top 0.5: v22.68,84.58 LED10.C
  Bottom 0.5: R26.2 23.42,82.77 LED10.C v22.69,84.58 v22.68,84.58
N$8  (via drill 0.3)
  Top 0.5: LED11.C 28.98,89.38 v28.98,86.14
  Bottom 0.5: v28.98,86.14 R27.2
NOT_BLOWN0  (via drill 0.5)
  Top 0.5: 54.88,77.64 55.94,78.7 v55.94,79.51
  Top 0.6: 54.88,77.64 IC1.4 50.38,77.64 49.68,78.34 49.68,80.04 49.25,80.47 46.99,80.47 46.54,80.02 IC2.2
  Bottom 0.5: R14.1 v55.94,79.51
NOT_BLOWN1  (via drill 0.5)
  Top 0.6: IC2.1 47.81,77.06 48.5,76.37 IC1.5 55.21,76.37 v55.85,77.01
  Bottom 0.6: R13.1 v55.85,77.01
NOT_BLOWN2  (via drill 0.5)
  Top 0.5: IC2.14 47.81,74.58 48.34,75.1 IC1.6
  Top 0.6: v55.86,74.53 55.28,75.1 IC1.6
  Bottom 0.6: R12.1 v55.86,74.53
NOT_BLOWN3  (via drill 0.5)
  Top 0.6: IC2.13 46.54,72.02 47.04,71.52 48.73,71.52 49.3,72.09 49.3,73.16 49.97,73.83 IC1.7 54.78,73.83 55.86,72.75 v55.86,72
  Bottom 0.5: R11.1 v55.86,72
P4
  Top 0.5: IC1.9 63.89,72.56 64.84,71.61 LED4.A
P5
  Top 0.5: IC1.10 64.17,73.83 64.4,73.6 LED5.A
P6
  Top 0.5: IC1.11 64.25,75.1 64.74,75.59 LED6.A
P7
  Top 0.5: IC1.12 64.07,76.37 65.3,77.6 LED7.A
PYRO0  (via drill 0.5)
  Top 0.5: ULN1.17 19.73,73.12 ULN1.18 | R3.2
  Top 0.7: ULN1.17 22.61,71.33
  Top 0.8: 22.61,71.33 28.17,71.33 32.79,75.95 32.79,80.77 v34,81.98 | v43.01,84.96 R3.2
  Top 1.5: P0.2 10.97,70.83 13.5,70.83 16.15,73.48 19.37,73.48 19.73,73.12
  Bottom 0.8: v34,81.98 40.04,81.98 v43.01,84.96
  Bottom 1: P0.2 R24.1
PYRO1
  Top 0.5: ULN1.15 21.59,74.97 ULN1.16
  Top 0.7: ULN1.15 23.97,73.57
  Top 0.8: 23.97,73.57 28.43,73.57 31.08,76.22 31.08,81.43 33.21,83.56 R4.2
  Top 1.5: P1.2 16.57,76.34 20.23,76.34 21.59,74.97
  Bottom 1: P1.2 R25.1
PYRO2  (via drill 0.5)
  Top 0.406: ULN1.14
  Top 0.5: ULN1.14 23.45,76.83 ULN1.13 | R5.2
  Top 0.6: v41.48,66.9 R5.2
  Top 0.7: ULN1.13 25.84,75.28
  Top 0.8: 25.84,75.28 v28.03,75.28
  Top 1.5: P2.2 21.41,82.54 21.41,78.88 23.45,76.83
  Bottom 0.7: v28.03,75.28 33.83,75.28 41.48,67.63 v41.48,66.9
  Bottom 1: P2.2 R26.1
PYRO3  (via drill 0.5)  (1 unrouted)
  Top 0.406: ULN1.12
  Top 0.5: ULN1.12 25.19,78.57 ULN1.11 | R6.2
  Top 0.6: v44.02,66.8 R6.2
  Top 0.7: 27.05,77.67 ULN1.11
  Top 0.8: v29.28,77.67 27.05,77.67
  Top 1.5: 26.81,88.32 P3.2 | 25.19,78.57 24.01,79.75 24.01,81.59 27,84.58 27,88.13 R27.1
  Bottom 0.7: v29.28,77.67 34.57,77.67 44.02,68.22 v44.02,66.8
  Bottom 1: P3.2 R27.1
PYRO_PROBE0
  Top 0.6: IC2.5 42.73,80.13 43,80.4 R3.1 R7.2
PYRO_PROBE1
  Top 0.6: IC2.7 40.19,80.18 40,80.37 R8.2 R4.1
PYRO_PROBE2
  Top 0.5: IC2.9 | R5.1 R9.2
  Top 0.6: IC2.9 R5.1
PYRO_PROBE3
  Top 0.5: IC2.11 | R6.1
  Top 0.6: IC2.11 R6.1 | R6.1 R10.2
U_1V8  (via drill 0.5)
  Top 1: J4.5 43.6,6.23 LED1.A
  Top 1.6: U1.VOUT 41,25.29 v43.72,28.01
  Bottom 1: 41,16.25 C1.+
  Bottom 1.6: J4.5 J4.7 J4.8 J4.6 | J4.6 J4.5 | U1.VOUT 41,16.25 | J4.6 43.65,11.05 40.75,13.95 C1.+ | v43.72,28.01 43.72,34.71 50.09,41.08 U$3.7
U_3V3  (via drill 0.3, 0.5)
  Top 0.5: v60.89,81.45 | IC1.2 54.64,80.18 55.9,81.45 | LED8.A v14.56,75.06 | v24.1,86.12 24.89,85.33 LED10.A | LED9.A 19.34,78.9 v20.5,77.74 | v26.9,82.06 26.9,82.74 31.46,87.3 31.46,89.97 LED11.A 31.52,91.92 v31.54,91.92 | v60.89,81.45 59.8,81.45 | 55.9,81.45 v60.89,81.45 | v41.26,88.22 49.13,88.22 55.9,81.45
  Top 0.6: v60.89,81.45 IC1.16
  Top 1: J4.9 LED2.A
  Top 1.5: U$3.8 52.63,48.82 | 52.63,48.82 52.63,63.62 v59.01,70 | U2.VOUT 54,27.49 v56.44,29.92 | U$3.1 34.85,47.34 36.33,48.82 52.63,48.82
  Bottom 0.5: v59.01,70 58.95,70.05 | v14.56,75.06 15.52,74.1 16.86,74.1 v20.5,77.74 25.84,83.08 | 25.84,83.08 25.84,84.38 v24.1,86.12 | v26.9,82.06 25.88,83.08 25.84,83.08 | v41.26,88.22 35.24,88.22 v31.54,91.92
  Bottom 0.8: v60.89,81.45 R14.2 R13.2 R12.2 R11.2 58.95,70.05
  Bottom 1: 52.67,45.17 U$3.8
  Bottom 1.5: v56.44,29.92 52.67,33.69 v52.67,41.15 52.67,45.17
  Bottom 1.6: J4.12 J4.11 J4.9 J4.10 J4.12 | J4.12 51.27,10.9 53.75,13.38 C2.+ 54,16.25 U2.VOUT
U_5V  (via drill 0.5)
  Top 1: J4.13 LED3.A
  Top 1.6: U3.VOUT 67,24.07 v62.62,28.46
  Bottom 1.5: U$3.9 55.17,35.9 v62.62,28.46
  Bottom 1.6: J4.16 J4.15 J4.13 J4.14 J4.16 | U3.VOUT 67,16.25 C3.+ 66.75,14.75 64,12 57.78,12 56.35,10.57 J4.16
U_IN  (via drill 0.5, 0.8)
  Top 0.5: R1.2
  Top 0.6: 14.42,82.08 14.42,82.18 | 19.89,87.64 19.88,87.64 | U$1.1 27,22.11
  Top 0.7: ULN1.10 v29.15,82.53
  Top 1: R1.2 v34.27,79.59 | 27,22.11 R15.1
  Top 1.6: 8.91,76.48 8.91,76.68 | U$1.1 25.78,22.01 | 48.92,19.1 48.88,19.06
  Top 2: P1.1 14.42,82.08 | P2.1 19.89,87.64 | U2.EN U2.VIN 48.92,19.1 | U3.VIN U3.EN 56.44,19.06 48.88,19.06 36.96,19.06 35.92,20.1 U1.VIN U1.EN 25.78,22.01 | P0.1 8.91,76.48 | U$1.1 24.33,20.78 19.52,20.78 5.15,35.15 3.83,35.15 2.73,36.25 2.73,62.17 7.6,67.04 7.6,70.51 5.8,72.31 5.8,73.57 8.91,76.68 14.42,82.18 19.88,87.64 24.96,92.72 26,92.72 P3.1
  Bottom 1: v34.27,79.59 32.09,79.59 v29.15,82.53
  Bottom 2: v29.15,82.53 32.1,85.48 32.1,87.46 27.97,91.59 P3.1

### Text on the board
tPlace: P3 | P0 | RedQueen2 / Supply v0.2 / 29.5.2021 / D.Madlener | 1.8V | 3.3V | 5.0V